# EAGLE schematic ESP_Module (EAGLE 9.2.0)
COMPANY: ADAFRUIT INDUSTRIES; DRAWN: KTOWN; REV: B
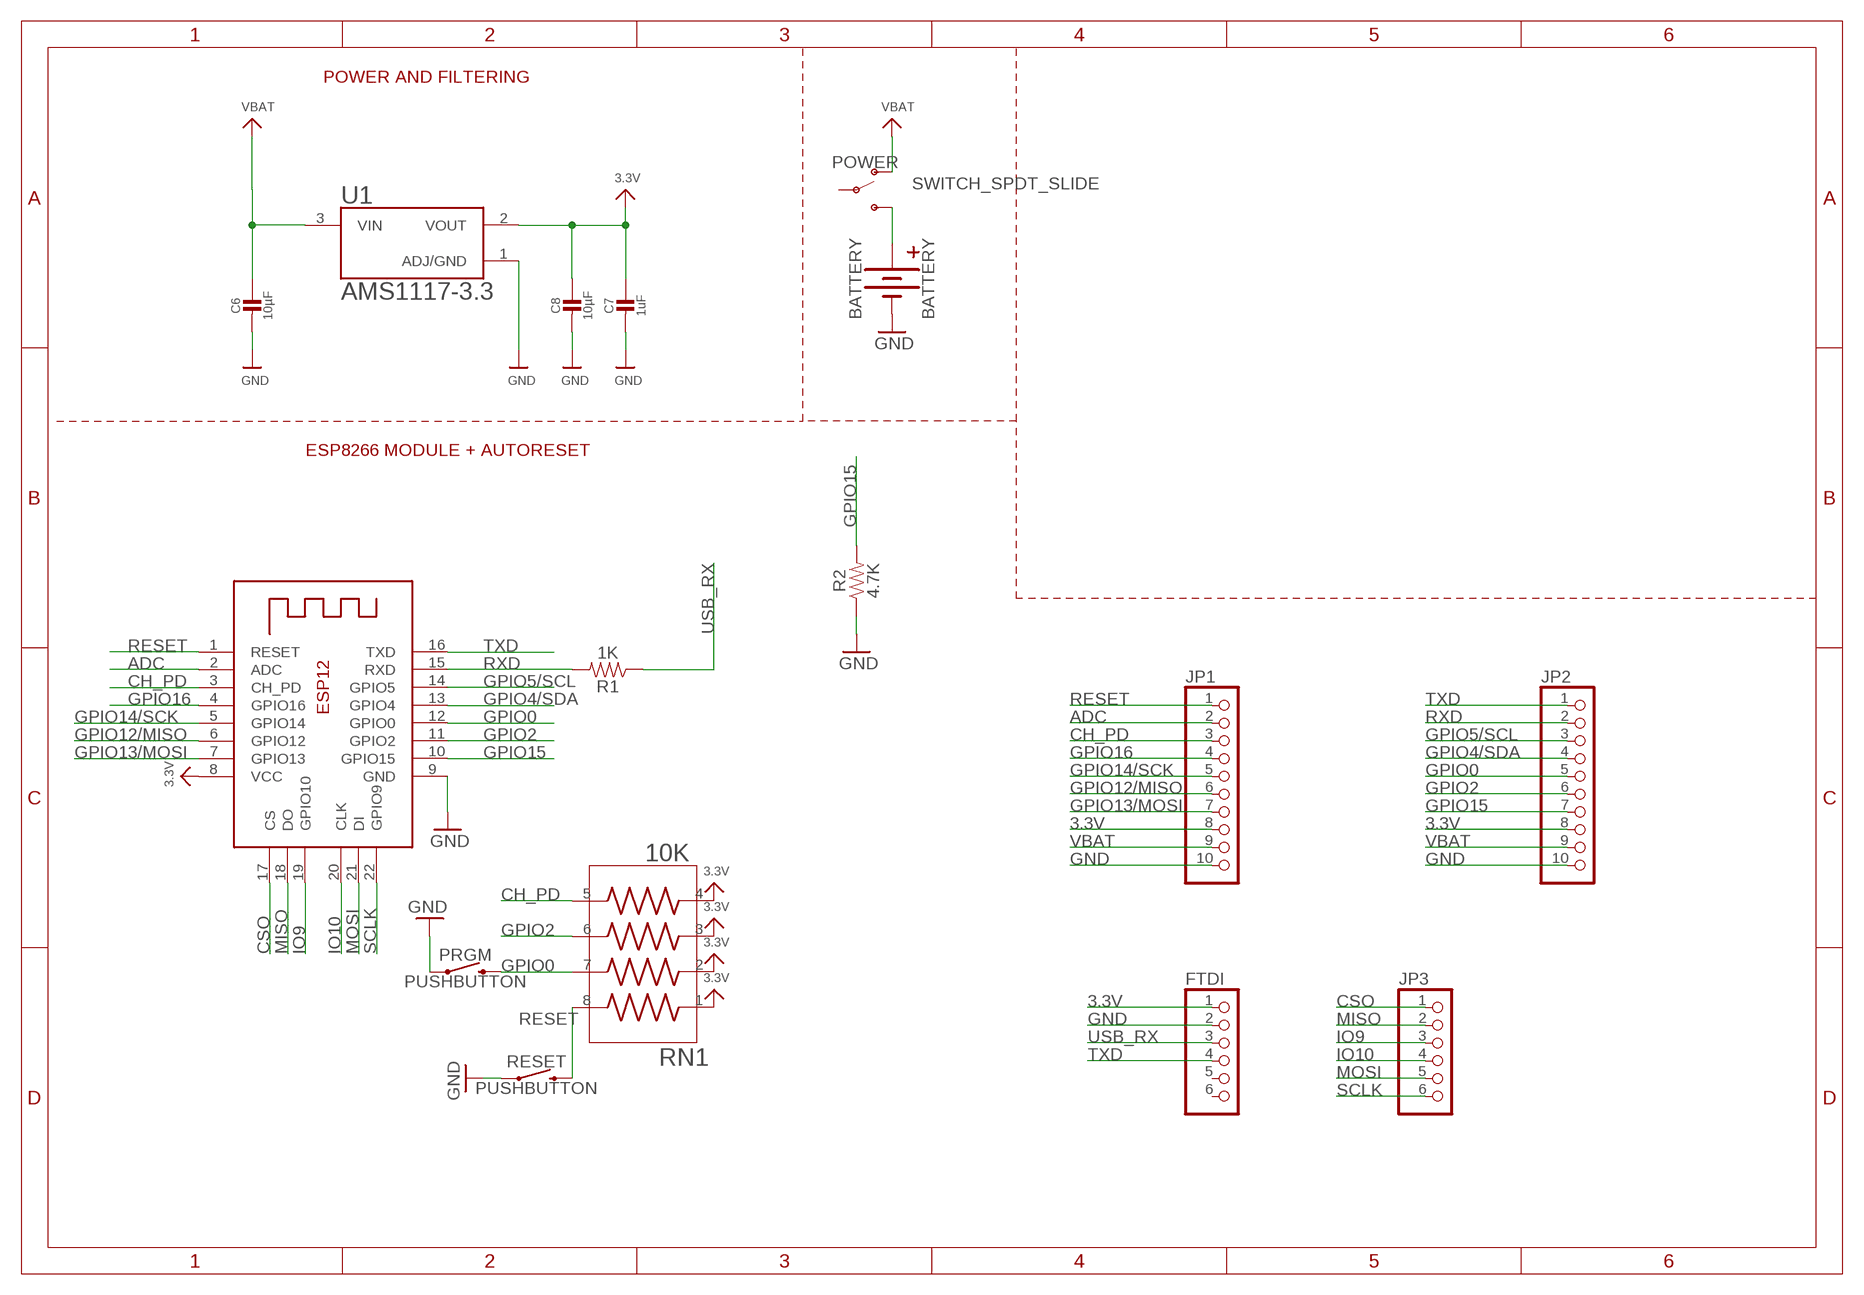
[diagram p0: schematic, sheet 1]

## Parts
BATTERY  BATTERY  [BATTERY-AA-KIT]
C6  10µF  CAP_CERAMIC0805-NOOUTLINE  [0805-NO]
C7  1uF  CAP_CERAMIC0603_NO  [0603-NO]
C8  10µF  CAP_CERAMIC0805-NOOUTLINE  [0805-NO]
FTDI  PINHD-1X6  [1X06]
JP1  PINHD-1X10  [1X10]
JP2  PINHD-1X10  [1X10]
JP3  PINHD-1X6  [1X06]
POWER  SWITCH_SPDT_SLIDE  [SWITCH_SPDT_PTH_11.6X4.0MM]
PRGM  PUSHBUTTON  [TACTILE_SWITCH_SMD_6.0X3.5MM]
R1  1K  RESISTOR1206  [1206]
R2  4.7K  RESISTOR1206  [1206]
RESET  PUSHBUTTON  [TACTILE_SWITCH_SMD_6.0X3.5MM]
RN1  10K  CAY16-750J4LF  [RESCAF80P320X160X60-8N]
U1  AMS1117-3.3  [SOT229P700X180-4N]
X2  ESP-12  ESP-12E  [ESP-12E]

## Nets
3.3V: C7.1 C8.1 FTDI.1 JP1.8 JP2.8 RN1.1 RN1.2 RN1.3 RN1.4 U1.2(VOUT) X2.8(VCC)
ADC: JP1.2 X2.2(ADC)
CH_PD: JP1.3 RN1.5 X2.3(CH_PD)
CSO: JP3.1 X2.17(CS)
GND: BATTERY.GND(-) C6.2 C7.2 C8.2 FTDI.2 JP1.10 JP2.10 PRGM.1 R2.1 RESET.1 U1.1(ADJ/GND) X2.9(GND)
GPIO0: JP2.5 PRGM.2 RN1.7 X2.12(GPIO0)
GPIO2: JP2.6 RN1.6 X2.11(GPIO2)
GPIO4/SDA: JP2.4 X2.13(GPIO4)
GPIO5/SCL: JP2.3 X2.14(GPIO5)
GPIO12/MISO: JP1.6 X2.6(GPIO12)
GPIO13/MOSI: JP1.7 X2.7(GPIO13)
GPIO14/SCK: JP1.5 X2.5(GPIO14)
GPIO15: JP2.7 R2.2 X2.10(GPIO15)
GPIO16: JP1.4 X2.4(GPIO16)
IO9: JP3.3 X2.19(GPIO10)
IO10: JP3.4 X2.20(CLK)
MISO: JP3.2 X2.18(DO)
MOSI: JP3.5 X2.21(DI)
N$1: C6.1 U1.3(VIN) ; supply symbol labelled VBAT
N$2: BATTERY.PWR(+) POWER.3(S)
RESET: JP1.1 RESET.2 RN1.8 X2.1(RESET)
RXD: JP2.2 R1.2 X2.15(RXD)
SCLK: JP3.6 X2.22(GPIO9)
TXD: FTDI.4 JP2.1 X2.16(TXD)
USB_RX: FTDI.3 R1.1
VBAT: JP1.9 JP2.9 POWER.1(O)
Unconnected: FTDI.5 FTDI.6 POWER.2(P)

## Notes on the sheet
- POWER AND FILTERING
- ESP8266 MODULE + AUTORESET

## Library data of the parts
BATTERY = AutoPark:BATTERY
C6-C8 = microbuilder:CAP_CERAMIC: Ceramic Capacitors For new designs, use the packages preceded by an '_' character since they are more reliable: The following footprints should be used on most boards: _0402 - Standard footprint for regular board layouts _0603 - Standard footprint for regular board layouts _0805 - Standard footprint for regular board layouts _1206 - Standard footprint for regular board layouts For extremely tight-pitch boards where space is at a premium, the following 'micro-pitch' footprints can be used (smaller pads, no silkscreen outline, etc.): _0402MP - Micro-pitch footprint for very dense/compact boards _0603MP - Micro-pitch footprint for very dense/compact boards _0805MP - Micro-pitch footprint for very dense/compact boards _1206MP - Micro-pitch footprint for very dense/compact boards
FTDI JP3 = pinhead:PINHD-1X6: PIN HEADER
JP1 JP2 = pinhead:PINHD-1X10: PIN HEADER
POWER = AutoPark:SWITCH_SPDT_SLIDE: 拨动开关SK12D07VG2/3/4/5/6 侧面5脚拨动带支架 3脚2档柄高6MM Taobao <https://item.taobao.com/item.htm?spm=a1z09.2.0.0.53a62e8d0RVocC&id=563254128682&_u=s1po4ce26496> Dimensional Drawing <https://img.alicdn.com/imgextra/i1/2744920356/TB2568GkMDD8KJjy0FdXXcjvXXa_!!2744920356.jpg>
PRGM RESET = AutoPark:PUSHBUTTON
R1 R2 = SparkFun-Resistors:RESISTOR: Generic Resistor Package
RN1 = AutoPark:CAY16-750J4LF: Res Thick Film Array 75 Ohm 5% 0.25W(1/4W) ?200ppm/C ISOL Molded 8-Pin 1206(4 X 0603) Convex SMD T/R; AVAILABILITY: Unavailable; DESCRIPTION: Res Thick Film Array 75 Ohm 5% 0.25W_1/4W_ ?200ppm/C ISOL Molded 8-Pin 1206_4 X 0603_ Convex SMD T/R; MF: Bourns; MP: CAY16-750J4LF; PACKAGE: 1206 Bourns; PRICE: None
U1 = AutoPark:AMS1117-3.3: Sot223/Pkg 1-Amp 3.3-Volt Low Drop Out Voltage Regulatator; AVAILABILITY: Unavailable; DESCRIPTION: Sot223/Pkg 1-Amp 3.3-Volt Low Drop Out Voltage Regulatator; MF: Advanced Monolithic Systems; MP: AMS1117-3.3; PACKAGE: None; PRICE: None
X2 = microbuilder:ESP-12E